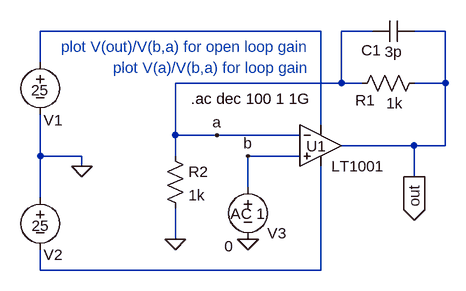
[diagram p0: schematic LoopGain.asc]
LoopGain.asc, the LTspice schematic file:
Version 4
SHEET 1 980 680
WIRE -240 32 -240 -16
WIRE -240 176 -240 112
WIRE -240 240 -240 176
WIRE -240 352 -240 320
WIRE -176 176 -240 176
WIRE -176 192 -176 176
WIRE -32 144 -32 64
WIRE -32 176 -32 144
WIRE -32 304 -32 256
WIRE 32 144 -32 144
WIRE 80 224 80 176
WIRE 160 144 32 144
WIRE 160 176 80 176
WIRE 192 -16 -240 -16
WIRE 192 128 192 -16
WIRE 192 352 -240 352
WIRE 192 352 192 192
WIRE 224 64 -32 64
WIRE 224 64 224 -16
WIRE 256 64 224 64
WIRE 272 -16 224 -16
WIRE 336 160 224 160
WIRE 336 208 336 160
WIRE 384 -16 336 -16
WIRE 384 64 336 64
WIRE 384 64 384 -16
WIRE 384 160 336 160
WIRE 384 160 384 64
FLAG -176 192 0
FLAG -32 304 0
FLAG 80 304 0
FLAG 32 144 a
FLAG 80 176 b
FLAG 336 208 out
IOPIN 336 208 Out
SYMBOL voltage -240 16 R0
WINDOW 0 5 105 Left 0
WINDOW 3 -14 59 Left 0
SYMATTR InstName V1
SYMATTR Value 25
SYMBOL voltage -240 224 R0
WINDOW 0 5 104 Left 0
WINDOW 3 -13 59 Left 0
SYMATTR InstName V2
SYMATTR Value 25
SYMBOL Opamps\\LT1001 192 96 R0
WINDOW 0 -22 65 Left 0
SYMATTR InstName U1
SYMBOL res 352 48 R90
WINDOW 0 58 91 VBottom 0
WINDOW 3 31 46 VTop 0
SYMATTR InstName R1
SYMATTR Value 1k
SYMBOL cap 336 -32 R90
WINDOW 0 61 66 VBottom 0
WINDOW 3 32 32 VTop 0
SYMATTR InstName C1
SYMATTR Value 3p
SYMBOL res -48 160 R0
SYMATTR InstName R2
SYMATTR Value 1k
SYMBOL voltage 80 208 R0
WINDOW 123 -27 57 Left 0
WINDOW 39 0 0 Left 0
WINDOW 0 30 87 Left 0
WINDOW 3 -36 107 Left 0
SYMATTR Value2 AC 1
SYMATTR InstName V3
SYMATTR Value 0
TEXT -8 88 Left 0 !.ac dec 100 1 1G
TEXT -208 8 Left 0 ;plot V(out)/V(b,a) for open loop gain
TEXT -128 40 Left 0 ;plot V(a)/V(b,a) for loop gain

The netlist it stands for:
* LoopGain.asc
V1 N001 0 25
V2 0 N002 25
XU1 b a N001 N002 out LT1001  ; pins In+ In- V+ V- OUT
R1 out a 1k
C1 out a 3p
R2 a 0 1k
V3 b 0 0 AC 1
.ac dec 100 1 1G
* plot V(out)/V(b,a) for open loop gain
* plot V(a)/V(b,a) for loop gain
.lib LTC.lib
.backanno
.end